# Altium project posedge-LogiX1_megawing.PrjPcb
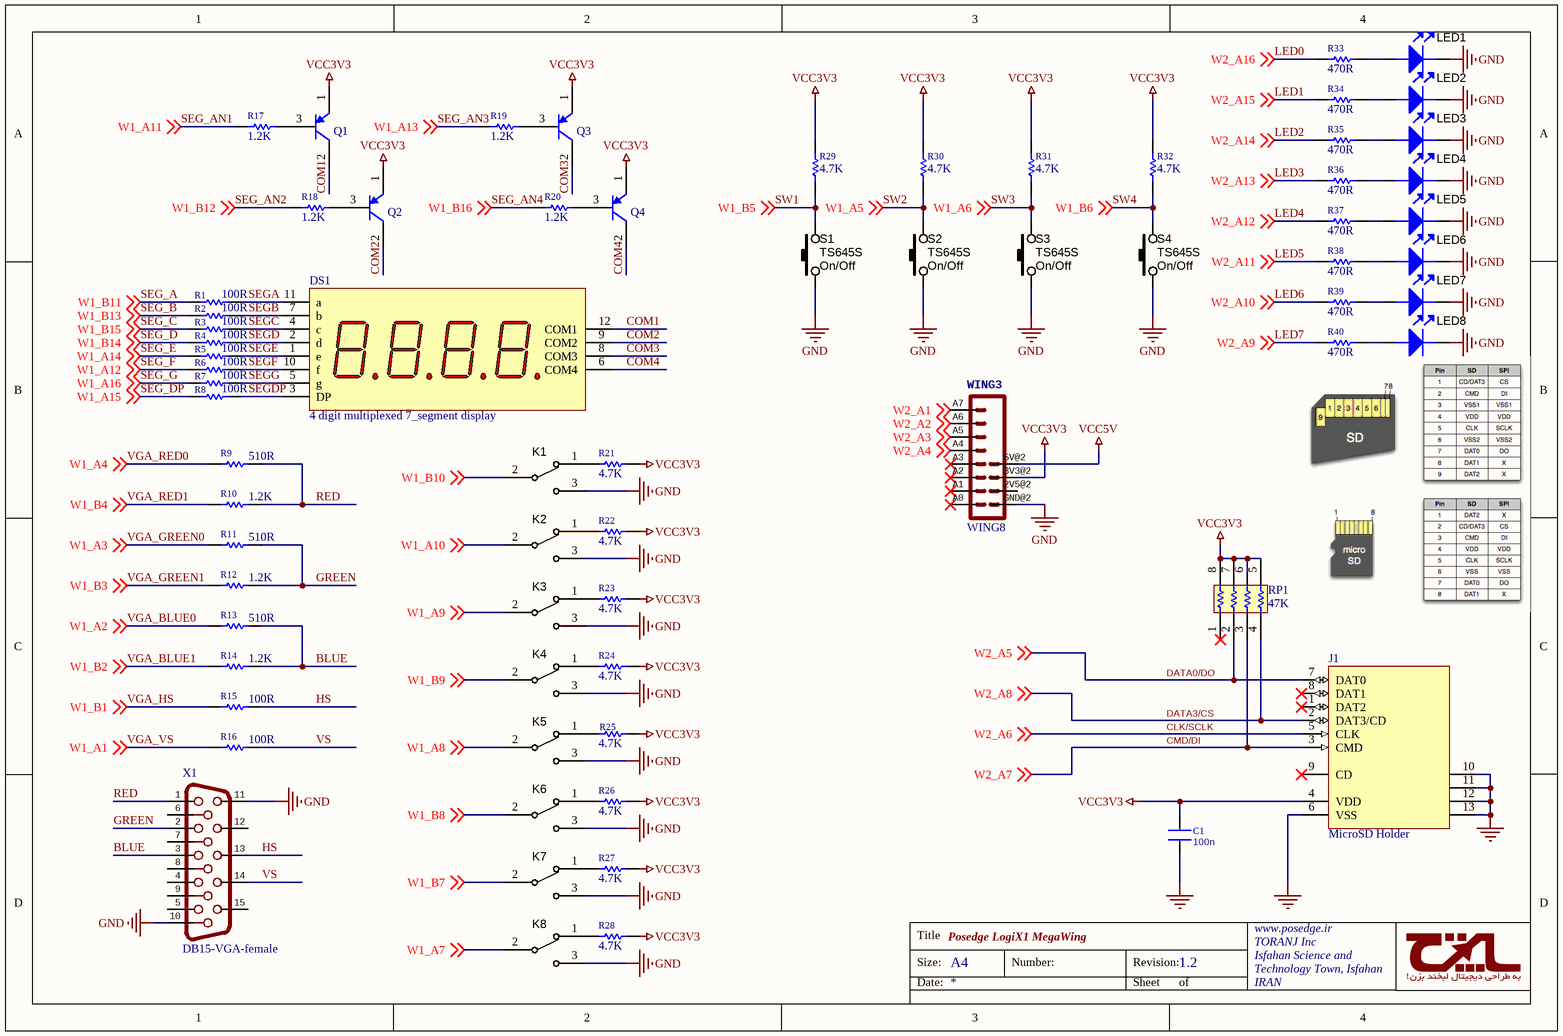
[diagram p0: Sheet1.SchDoc]
2 sheets, 76 parts. Net scope: global (net labels, ports and power ports of the same name join across sheets).
Board file: Posedge_LogiX1_MegaWing.PcbDoc
Sheets:
  Sheet1.SchDoc
  wing.SchDoc

## Sheet Sheet1.SchDoc: Posedge LogiX1 MegaWing
size A4; Organization: www.posedge.ir; Address1: TORANJ Inc; Address2: Isfahan Science and; Address3: Technology Town, Isfahan; Address4: IRAN; Revision: 1.2

### Parts
C1  100n  [C0805_M]
DS1  4 digit multiplexed 7_segment display  [7SEG-MPX4-CA]
J1  MicroSD Holder  [micro sd soket]
K1  Slide Switch 3Pin  [SWITCH_SPDT_SLIDER]  (value not drawn)
K2  Slide Switch 3Pin  [SWITCH_SPDT_SLIDER]  (value not drawn)
K3  Slide Switch 3Pin  [SWITCH_SPDT_SLIDER]  (value not drawn)
K4  Slide Switch 3Pin  [SWITCH_SPDT_SLIDER]  (value not drawn)
K5  Slide Switch 3Pin  [SWITCH_SPDT_SLIDER]  (value not drawn)
K6  Slide Switch 3Pin  [SWITCH_SPDT_SLIDER]  (value not drawn)
K7  Slide Switch 3Pin  [SWITCH_SPDT_SLIDER]  (value not drawn)
K8  Slide Switch 3Pin  [SWITCH_SPDT_SLIDER]  (value not drawn)
LED1  (no value)  [LED_0805]
LED2  (no value)  [LED_0805]
LED3  (no value)  [LED_0805]
LED4  (no value)  [LED_0805]
LED5  (no value)  [LED_0805]
LED6  (no value)  [LED_0805]
LED7  (no value)  [LED_0805]
LED8  (no value)  [LED_0805]
Q1  A733  [TO-92]  (value not drawn)
Q2  A733  [TO-92]  (value not drawn)
Q3  A733  [TO-92]  (value not drawn)
Q4  A733  [TO-92]  (value not drawn)
R1  100R  [R0805_M]
R2  100R  [R0805_M]
R3  100R  [R0805_M]
R4  100R  [R0805_M]
R5  100R  [R0805_M]
R6  100R  [R0805_M]
R7  100R  [R0805_M]
R8  100R  [R0805_M]
R9  510R  [R0805_M]
R10  1.2K  [R0805_M]
R11  510R  [R0805_M]
R12  1.2K  [R0805_M]
R13  510R  [R0805_M]
R14  1.2K  [R0805_M]
R15  100R  [R0805_M]
R16  100R  [R0805_M]
R17  1.2K  [R0805_M]
R18  1.2K  [R0805_M]
R19  1.2K  [R0805_M]
R20  1.2K  [R0805_M]
R21  4.7K  [R0805_M]
R22  4.7K  [R0805_M]
R23  4.7K  [R0805_M]
R24  4.7K  [R0805_M]
R25  4.7K  [R0805_M]
R26  4.7K  [R0805_M]
R27  4.7K  [R0805_M]
R28  4.7K  [R0805_M]
R29  4.7K  [R0805_M]
R30  4.7K  [R0805_M]
R31  4.7K  [R0805_M]
R32  4.7K  [R0805_M]
R33  470R  [R0805_M]
R34  470R  [R0805_M]
R35  470R  [R0805_M]
R36  470R  [R0805_M]
R37  470R  [R0805_M]
R38  470R  [R0805_M]
R39  470R  [R0805_M]
R40  470R  [R0805_M]
RP1  47K  [RESCAXS50P160X320X70-8N]
S1  TS645S  Function: On/Off  [TS645S]
S2  TS645S  Function: On/Off  [TS645S]
S3  TS645S  Function: On/Off  [TS645S]
S4  TS645S  Function: On/Off  [TS645S]
WING3  WING8  [WINGSIDE_8BIT]
X1  DB15-VGA-female  [HDF15H]

### Nets
GND: C1.1 J1.6(VSS) J1.10 J1.11 J1.12 J1.13 K1.3 K2.3 K3.3 K4.3 K5.3 K6.3 K7.3 K8.3 LED1.1(cathode) LED2.1(cathode) LED3.1(cathode) LED4.1(cathode) LED5.1(cathode) LED6.1(cathode) LED7.1(cathode) LED8.1(cathode) S1.1 S2.1 S3.1 S4.1 WING3.GND@2(GND) X1.10 X1.11
VCC3V3: C1.2 J1.4(VDD) Q1.1(E) Q2.1(E) Q3.1(E) Q4.1(E) R21.1 R22.1 R23.1 R24.1 R25.1 R26.1 R27.1 R28.1 R29.2 R30.2 R31.2 R32.2 RP1.5 RP1.6 RP1.7 RP1.8 WING3.3V3@2(3V3)
VCC5V: WING3.5V@2(5V)
BLUE: R13.1 R14.1 X1.3
CLK/SCLK: J1.5(CLK) ; off-sheet W2_A6  [also labelled W2_A6]
CMD/DI: J1.3(CMD) RP1.3 ; off-sheet W2_A7  [also labelled W2_A7]
COM1: DS1.12(COM1) Q1.2(C)
COM2: DS1.9(COM2) Q2.2(C)
COM3: DS1.8(COM3) Q3.2(C)
COM4: DS1.6(COM4) Q4.2(C)
DATA0/DO: J1.7(DAT0) RP1.2 ; off-sheet W2_A5  [also labelled W2_A5]
DATA3/CS: J1.2(DAT3/CD) RP1.4 ; off-sheet W2_A8  [also labelled W2_A8]
GREEN: R11.1 R12.1 X1.2
HS: R15.1 X1.13
LED0: R33.2 ; off-sheet W2_A16  [also labelled W2_A16]
LED1: R34.2 ; off-sheet W2_A15  [also labelled W2_A15]
LED2: R35.2 ; off-sheet W2_A14  [also labelled W2_A14]
LED3: R36.2 ; off-sheet W2_A13  [also labelled W2_A13]
LED4: R37.2 ; off-sheet W2_A12  [also labelled W2_A12]
LED5: R38.2 ; off-sheet W2_A11  [also labelled W2_A11]
LED6: R39.2 ; off-sheet W2_A10  [also labelled W2_A10]
LED7: R40.2 ; off-sheet W2_A9  [also labelled W2_A9]
RED: R9.1 R10.1 X1.1
SEG_A: R1.1 ; off-sheet W1_B11  [also labelled W1_B11]
SEG_AN1: R17.2 ; off-sheet W1_A11  [also labelled W1_A11]
SEG_AN2: R18.2 ; off-sheet W1_B12  [also labelled W1_B12]
SEG_AN3: R19.2 ; off-sheet W1_A13  [also labelled W1_A13]
SEG_AN4: R20.2 ; off-sheet W1_B16  [also labelled W1_B16]
SEG_B: R2.1 ; off-sheet W1_B13  [also labelled W1_B13]
SEG_C: R3.1 ; off-sheet W1_B15  [also labelled W1_B15]
SEG_D: R4.1 ; off-sheet W1_B14  [also labelled W1_B14]
SEG_DP: R8.1 ; off-sheet W1_A15  [also labelled W1_A15]
SEG_E: R5.1 ; off-sheet W1_A14  [also labelled W1_A14]
SEG_F: R6.1 ; off-sheet W1_A12  [also labelled W1_A12]
SEG_G: R7.1 ; off-sheet W1_A16  [also labelled W1_A16]
SEGA: DS1.11(a) R1.2
SEGB: DS1.7(b) R2.2
SEGC: DS1.4(c) R3.2
SEGD: DS1.2(d) R4.2
SEGDP: DS1.3(DP) R8.2
SEGE: DS1.1(e) R5.2
SEGF: DS1.10(f) R6.2
SEGG: DS1.5(g) R7.2
SW1: R29.1 S1.2 ; off-sheet W1_B5  [also labelled W1_B5]
SW2: R30.1 S2.2 ; off-sheet W1_A5  [also labelled W1_A5]
SW3: R31.1 S3.2 ; off-sheet W1_A6  [also labelled W1_A6]
SW4: R32.1 S4.2 ; off-sheet W1_B6  [also labelled W1_B6]
VGA_BLUE0: R13.2 ; off-sheet W1_A2  [also labelled W1_A2]
VGA_BLUE1: R14.2 ; off-sheet W1_B2  [also labelled W1_B2]
VGA_GREEN0: R11.2 ; off-sheet W1_A3  [also labelled W1_A3]
VGA_GREEN1: R12.2 ; off-sheet W1_B3  [also labelled W1_B3]
VGA_HS: R15.2 ; off-sheet W1_B1  [also labelled W1_B1]
VGA_RED0: R9.2 ; off-sheet W1_A4  [also labelled W1_A4]
VGA_RED1: R10.2 ; off-sheet W1_B4  [also labelled W1_B4]
VGA_VS: R16.2 ; off-sheet W1_A1  [also labelled W1_A1]
VS: R16.1 X1.14
W1_A7: K8.2 ; off-sheet W1_A7
W1_A8: K5.2 ; off-sheet W1_A8
W1_A9: K3.2 ; off-sheet W1_A9
W1_A10: K2.2 ; off-sheet W1_A10
W1_B7: K7.2 ; off-sheet W1_B7
W1_B8: K6.2 ; off-sheet W1_B8
W1_B9: K4.2 ; off-sheet W1_B9
W1_B10: K1.2 ; off-sheet W1_B10
W2_A1: WING3.A7 ; off-sheet W2_A1
W2_A2: WING3.A6 ; off-sheet W2_A2
W2_A3: WING3.A5 ; off-sheet W2_A3
W2_A4: WING3.A4 ; off-sheet W2_A4
NetK1_1: K1.1 R21.2
NetK2_1: K2.1 R22.2
NetK3_1: K3.1 R23.2
NetK4_1: K4.1 R24.2
NetK5_1: K5.1 R25.2
NetK6_1: K6.1 R26.2
NetK7_1: K7.1 R27.2
NetK8_1: K8.1 R28.2
NetLED1_2: LED1.2(ANODE) R33.1
NetLED2_2: LED2.2(ANODE) R34.1
NetLED3_2: LED3.2(ANODE) R35.1
NetLED4_2: LED4.2(ANODE) R36.1
NetLED5_2: LED5.2(ANODE) R37.1
NetLED6_2: LED6.2(ANODE) R38.1
NetLED7_2: LED7.2(ANODE) R39.1
NetLED8_2: LED8.2(ANODE) R40.1
NetQ1_3: Q1.3(B) R17.1
NetQ2_3: Q2.3(B) R18.1
NetQ3_3: Q3.3(B) R19.1
NetQ4_3: Q4.3(B) R20.1

Not connected (* = marked no-connect by the designer): J1 1(DAT2)* 8(DAT1)* 9(CD)*; RP1 1*; WING3 2V5@2(2V5) A0* A1* A2* A3*; X1 4 5 6 7 8 9 12 15

### Notes on the sheet
- Title
- Size:
- Date:
- A4
- Number:
- Revision:
- Sheet
- of

### Library data of the parts
C1 = C0805: Ceramic Capactor size 0805; Supplier: *; Value: 100n
DS1 = 7SEG-MPX4-CA: 7-Segment 4-Digits
J1 = MicroSD: MicroSD Memory Card Holder
K1-K8 = SW_THD_SPDT_On-On: Switch THD vertical toggle SPDT; Manufacturer 1: TE Connectivity; Manufacturer Part Number 1: SLS121PC04; Contact Rating @ Voltage: 0.25A @ 125VAC; SCDType: spec; Circuit: SPDT; Mounting Type: PCB mount; Supplier 1: Digi-Key; Supplier Part Number 1: 450-1598-ND
LED1-LED8 = LED_0805: LED, 0805 SMD; Manufacturer 1: LITE-ON; Manufacturer Part Number 1: LTST-C171GKT; Material: GaP; Ratings: 6 mcd; 569 nm; SCDType: source; Package / Case: 0805; Supplier 1: Digi-Key; Supplier Part Number 1: 160-1423-1-ND; Value: =Color
Q1-Q4 = A733: PNP Bipolar Transistor; Code_JEDEC: TO-92
R1-R40 = R0805: Chip Resistor size 0805
  R1-R8: value: 100R
  R9 R11 R13: Value: 510R
  R10 R12 R14 R17-R20: Value: 1.2K
  R15 R16: Value: 100R
  R21-R32: Value: 4.7K
  R33-R40: Value: 470R
RP1 = RESPACK_4X: Isolated Resistor Network; Value: 47K
S1-S4 = SW_SMD_4Pin: SMT Tactile Switch (6mm x 6mm); Manufacturer 1: Bond-Tact; Manufacturer Part Number 1: TS-1143S-WP-200; SCDType: spec; Package / Case: 6.5x6.5mm; 4.3mm stem
X1 = HF15H: VGA Connector Right angle; OC_FARNELL: unknown; OC_NEWARK: unknown

## Sheet wing.SchDoc: Posedge LogiX1 MegaWing
size A; Organization: www.posedge.ir; Address1: TORANJ Inc.; Address2: Isfahan Science and; Address3: Technology Town, Isfahan; Address4: IRAN; Revision: 1.2; ProjectName: Posegde One
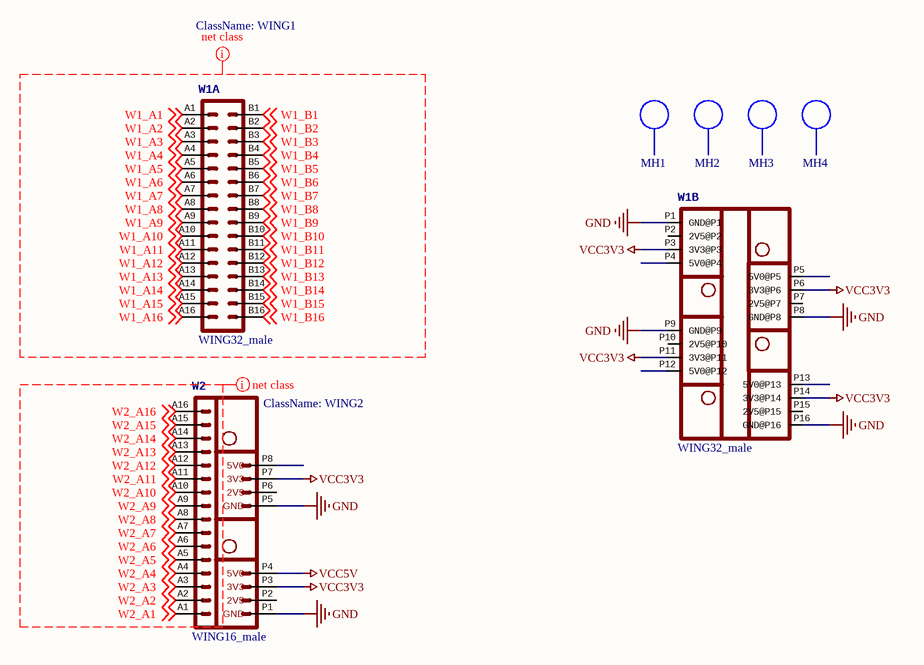
[diagram p1: wing.SchDoc]

### Parts
MH1  MOUNTING HOLE  [MOUNTING_HOLE]  (value not drawn)  (no BOM)
MH2  MOUNTING HOLE  [MOUNTING_HOLE]  (value not drawn)  (no BOM)
MH3  MOUNTING HOLE  [MOUNTING_HOLE]  (value not drawn)  (no BOM)
MH4  MOUNTING HOLE  [MOUNTING_HOLE]  (value not drawn)  (no BOM)
W1  WING32_male  [WING32_HOLES - MALE]  (parts A,B of 2)
W2  WING16_male  [WINGSIDE_16BIT - male]

### Nets
GND: W1.P1(GND@P1) W1.P8(GND@P8) W1.P9(GND@P9) W1.P16(GND@P16) W2.P1(GND) W2.P5(GND)
VCC3V3: W1.P3(3V3@P3) W1.P6(3V3@P6) W1.P11(3V3@P11) W1.P14(3V3@P14) W2.P3(3V3) W2.P7(3V3)
VCC5V: W2.P4(5V)
W1_A1: W1.A1 ; off-sheet W1_A1  [project net VGA_VS]
W1_A2: W1.A2 ; off-sheet W1_A2  [project net VGA_BLUE0]
W1_A3: W1.A3 ; off-sheet W1_A3  [project net VGA_GREEN0]
W1_A4: W1.A4 ; off-sheet W1_A4  [project net VGA_RED0]
W1_A5: W1.A5 ; off-sheet W1_A5  [project net SW2]
W1_A6: W1.A6 ; off-sheet W1_A6  [project net SW3]
W1_A7: W1.A7 ; off-sheet W1_A7
W1_A8: W1.A8 ; off-sheet W1_A8
W1_A9: W1.A9 ; off-sheet W1_A9
W1_A10: W1.A10 ; off-sheet W1_A10
W1_A11: W1.A11 ; off-sheet W1_A11  [project net SEG_AN1]
W1_A12: W1.A12 ; off-sheet W1_A12  [project net SEG_F]
W1_A13: W1.A13 ; off-sheet W1_A13  [project net SEG_AN3]
W1_A14: W1.A14 ; off-sheet W1_A14  [project net SEG_E]
W1_A15: W1.A15 ; off-sheet W1_A15  [project net SEG_DP]
W1_A16: W1.A16 ; off-sheet W1_A16  [project net SEG_G]
W1_B1: W1.B1 ; off-sheet W1_B1  [project net VGA_HS]
W1_B2: W1.B2 ; off-sheet W1_B2  [project net VGA_BLUE1]
W1_B3: W1.B3 ; off-sheet W1_B3  [project net VGA_GREEN1]
W1_B4: W1.B4 ; off-sheet W1_B4  [project net VGA_RED1]
W1_B5: W1.B5 ; off-sheet W1_B5  [project net SW1]
W1_B6: W1.B6 ; off-sheet W1_B6  [project net SW4]
W1_B7: W1.B7 ; off-sheet W1_B7
W1_B8: W1.B8 ; off-sheet W1_B8
W1_B9: W1.B9 ; off-sheet W1_B9
W1_B10: W1.B10 ; off-sheet W1_B10
W1_B11: W1.B11 ; off-sheet W1_B11  [project net SEG_A]
W1_B12: W1.B12 ; off-sheet W1_B12  [project net SEG_AN2]
W1_B13: W1.B13 ; off-sheet W1_B13  [project net SEG_B]
W1_B14: W1.B14 ; off-sheet W1_B14  [project net SEG_D]
W1_B15: W1.B15 ; off-sheet W1_B15  [project net SEG_C]
W1_B16: W1.B16 ; off-sheet W1_B16  [project net SEG_AN4]
W2_A1: W2.A1 ; off-sheet W2_A1
W2_A2: W2.A2 ; off-sheet W2_A2
W2_A3: W2.A3 ; off-sheet W2_A3
W2_A4: W2.A4 ; off-sheet W2_A4
W2_A5: W2.A5 ; off-sheet W2_A5  [project net DATA0/DO]
W2_A6: W2.A6 ; off-sheet W2_A6  [project net CLK/SCLK]
W2_A7: W2.A7 ; off-sheet W2_A7  [project net CMD/DI]
W2_A8: W2.A8 ; off-sheet W2_A8  [project net DATA3/CS]
W2_A9: W2.A9 ; off-sheet W2_A9  [project net LED7]
W2_A10: W2.A10 ; off-sheet W2_A10  [project net LED6]
W2_A11: W2.A11 ; off-sheet W2_A11  [project net LED5]
W2_A12: W2.A12 ; off-sheet W2_A12  [project net LED4]
W2_A13: W2.A13 ; off-sheet W2_A13  [project net LED3]
W2_A14: W2.A14 ; off-sheet W2_A14  [project net LED2]
W2_A15: W2.A15 ; off-sheet W2_A15  [project net LED1]
W2_A16: W2.A16 ; off-sheet W2_A16  [project net LED0]

Not connected (* = marked no-connect by the designer): MH1 1; MH2 1; MH3 1; MH4 1; W1 P2(2V5@P2) P4(5V0@P4) P5(5V0@P5) P7(2V5@P7) P10(2V5@P10) P12(5V0@P12) P13(5V0@P13) P15(2V5@P15); W2 P2(2V2) P6(2V5) P8(5V)

### Layout directives
net class WING1: W1_A1, W1_A2, W1_A3, W1_A4, W1_A5, W1_A6, W1_A7, W1_A8, W1_A9, W1_A10, W1_A11, W1_A12, W1_A13, W1_A14, W1_A15, W1_A16, W1_B1, W1_B2, W1_B3, W1_B4, W1_B5, W1_B6, W1_B7, W1_B8, W1_B9, W1_B10, W1_B11, W1_B12, W1_B13, W1_B14, W1_B15, W1_B16
net class WING2: W2_A1, W2_A2, W2_A3, W2_A4, W2_A5, W2_A6, W2_A7, W2_A8, W2_A9, W2_A10, W2_A11, W2_A12, W2_A13, W2_A14, W2_A15, W2_A16

### Notes on the sheet
- Title
- Size:
- Date:
- A
- Number:
- Revision:
- Sheet
- of
- (in symbol WING16_male) 5V0

### Library data of the parts
MH1-MH4 = MOUNTING_HOLE
W2 = WING16_male: Papilio Wing16

## Nets that join several sheets
GND: Sheet1 (29 pins), wing (6 pins)
VCC3V3: Sheet1 (23 pins), wing (6 pins)
VCC5V: Sheet1 (WING3.5V@2), wing (W2.P4)
CLK/SCLK: Sheet1 (J1.5), wing (W2.A6)
CMD/DI: Sheet1 (J1.3 RP1.3), wing (W2.A7)
DATA0/DO: Sheet1 (J1.7 RP1.2), wing (W2.A5)
DATA3/CS: Sheet1 (J1.2 RP1.4), wing (W2.A8)
LED0: Sheet1 (R33.2), wing (W2.A16)
LED1: Sheet1 (R34.2), wing (W2.A15)
LED2: Sheet1 (R35.2), wing (W2.A14)
LED3: Sheet1 (R36.2), wing (W2.A13)
LED4: Sheet1 (R37.2), wing (W2.A12)
LED5: Sheet1 (R38.2), wing (W2.A11)
LED6: Sheet1 (R39.2), wing (W2.A10)
LED7: Sheet1 (R40.2), wing (W2.A9)
SEG_A: Sheet1 (R1.1), wing (W1.B11)
SEG_AN1: Sheet1 (R17.2), wing (W1.A11)
SEG_AN2: Sheet1 (R18.2), wing (W1.B12)
SEG_AN3: Sheet1 (R19.2), wing (W1.A13)
SEG_AN4: Sheet1 (R20.2), wing (W1.B16)
SEG_B: Sheet1 (R2.1), wing (W1.B13)
SEG_C: Sheet1 (R3.1), wing (W1.B15)
SEG_D: Sheet1 (R4.1), wing (W1.B14)
SEG_DP: Sheet1 (R8.1), wing (W1.A15)
SEG_E: Sheet1 (R5.1), wing (W1.A14)
SEG_F: Sheet1 (R6.1), wing (W1.A12)
SEG_G: Sheet1 (R7.1), wing (W1.A16)
SW1: Sheet1 (R29.1 S1.2), wing (W1.B5)
SW2: Sheet1 (R30.1 S2.2), wing (W1.A5)
SW3: Sheet1 (R31.1 S3.2), wing (W1.A6)
SW4: Sheet1 (R32.1 S4.2), wing (W1.B6)
VGA_BLUE0: Sheet1 (R13.2), wing (W1.A2)
VGA_BLUE1: Sheet1 (R14.2), wing (W1.B2)
VGA_GREEN0: Sheet1 (R11.2), wing (W1.A3)
VGA_GREEN1: Sheet1 (R12.2), wing (W1.B3)
VGA_HS: Sheet1 (R15.2), wing (W1.B1)
VGA_RED0: Sheet1 (R9.2), wing (W1.A4)
VGA_RED1: Sheet1 (R10.2), wing (W1.B4)
VGA_VS: Sheet1 (R16.2), wing (W1.A1)
W1_A7: Sheet1 (K8.2), wing (W1.A7)
W1_A8: Sheet1 (K5.2), wing (W1.A8)
W1_A9: Sheet1 (K3.2), wing (W1.A9)
W1_A10: Sheet1 (K2.2), wing (W1.A10)
W1_B7: Sheet1 (K7.2), wing (W1.B7)
W1_B8: Sheet1 (K6.2), wing (W1.B8)
W1_B9: Sheet1 (K4.2), wing (W1.B9)
W1_B10: Sheet1 (K1.2), wing (W1.B10)
W2_A1: Sheet1 (WING3.A7), wing (W2.A1)
W2_A2: Sheet1 (WING3.A6), wing (W2.A2)
W2_A3: Sheet1 (WING3.A5), wing (W2.A3)
W2_A4: Sheet1 (WING3.A4), wing (W2.A4)